# EAGLE design merope-central (EAGLE 6.5.0)
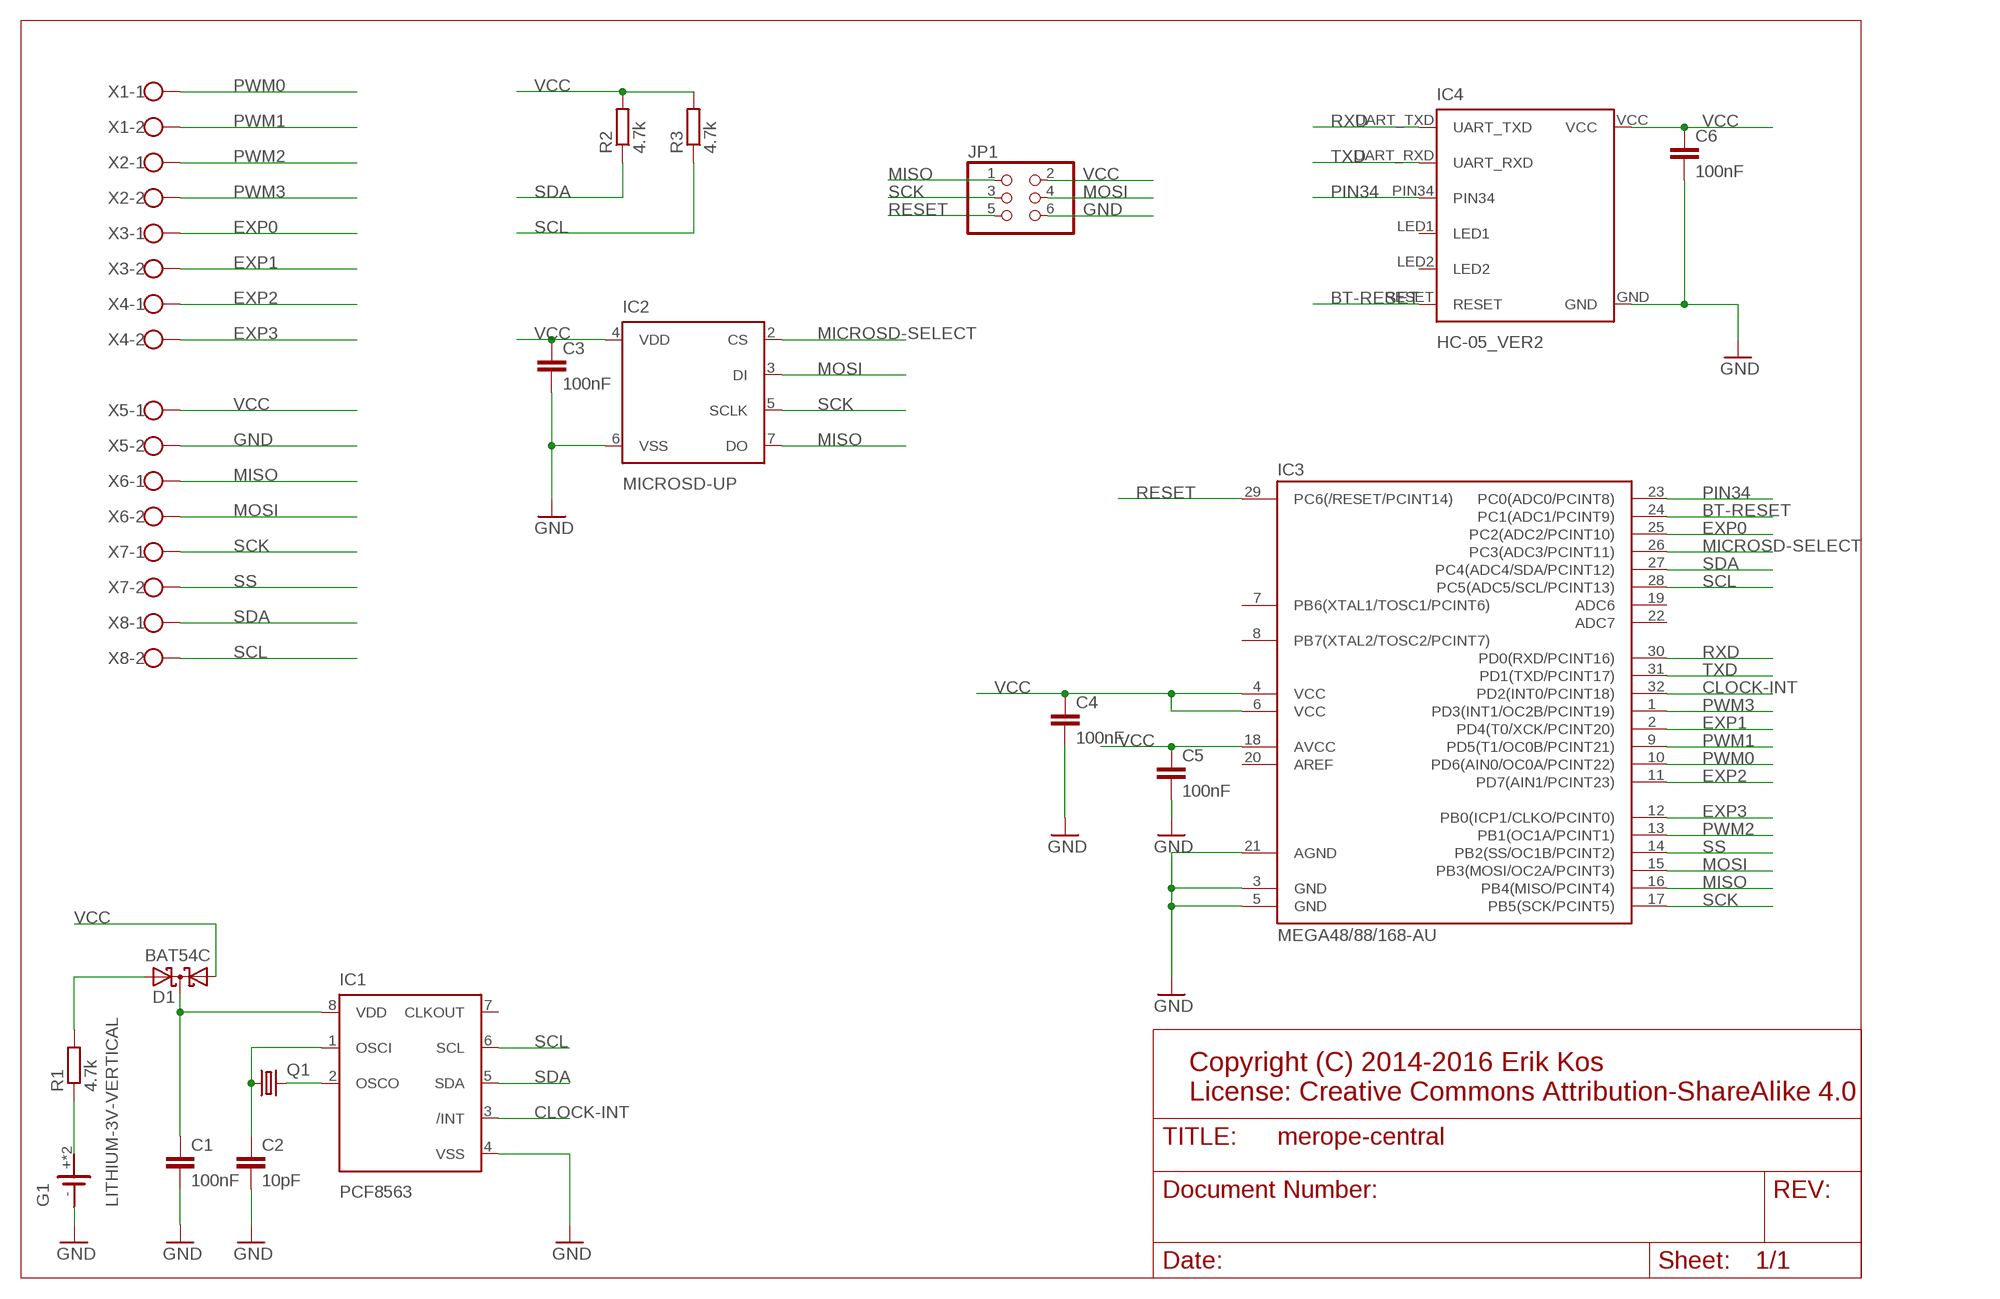
[diagram p0: schematic, sheet 1]

## Parts
C1  100nF  C-EUC0805  [C0805]
C2  10pF  C-EUC0805  [C0805]
C3  100nF  C-EUC0805  [C0805]
C4  100nF  C-EUC0805  [C0805]
C5  100nF  C-EUC0805  [C0805]
C6  100nF  C-EUC0805  [C0805]
D1  BAT54C  [SOT23]
G1  LITHIUM-3V-VERTICAL  [LITHIUM-3V-VERTICAL]
IC1  PCF8563  [SO8]
IC2  MICROSD-UP  [MICROSD-UP]
IC3  MEGA48/88/168-AU  [TQFP32-08]
IC4  HC-05_VER2  [HC-05_VER2]
JP1  PINHD-2X3  [2X03]
Q1  CRYSTALTC26V  [TC26V]
R1  4.7k  R-EU_M0805  [M0805]
R2  4.7k  R-EU_M0805  [M0805]
R3  4.7k  R-EU_M0805  [M0805]
X1  TERMINAL_BLOCK_35_2  [TERMINAL_BLOCK_35_2]
X2  TERMINAL_BLOCK_35_2  [TERMINAL_BLOCK_35_2]
X3  TERMINAL_BLOCK_35_2  [TERMINAL_BLOCK_35_2]
X4  TERMINAL_BLOCK_35_2  [TERMINAL_BLOCK_35_2]
X5  TERMINAL_BLOCK_35_2  [TERMINAL_BLOCK_35_2]
X6  TERMINAL_BLOCK_35_2  [TERMINAL_BLOCK_35_2]
X7  TERMINAL_BLOCK_35_2  [TERMINAL_BLOCK_35_2]
X8  TERMINAL_BLOCK_35_2  [TERMINAL_BLOCK_35_2]

## Nets
BT-RESET: IC3.24(PC1(ADC1/PCINT9)) IC4.RESET
CLOCK-INT: IC1.3(/INT) IC3.32(PD2(INT0/PCINT18))
EXP0: IC3.25(PC2(ADC2/PCINT10)) X3.1
EXP1: IC3.2(PD4(T0/XCK/PCINT20)) X3.2
EXP2: IC3.11(PD7(AIN1/PCINT23)) X4.1
EXP3: IC3.12(PB0(ICP1/CLKO/PCINT0)) X4.2
GND [16mils]: C1.2 C2.2 C3.2 C4.2 C5.2 C6.2 G1.- IC1.4(VSS) IC2.6(VSS) IC3.3(GND) IC3.5(GND) IC3.21(AGND) IC4.GND JP1.6 X5.2
MICROSD-SELECT: IC2.2(CS) IC3.26(PC3(ADC3/PCINT11))
MISO: IC2.7(DO) IC3.16(PB4(MISO/PCINT4)) JP1.1 X6.1
MOSI: IC2.3(DI) IC3.15(PB3(MOSI/OC2A/PCINT3)) JP1.4 X6.2
N$1: C1.1 D1.3(CC) IC1.8(VDD)
N$6: G1.+ G1.+1(+) R1.1
N$7: D1.2(A2) R1.2
N$14: IC1.2(OSCO) Q1.2
N$15: C2.1 IC1.1(OSCI) Q1.1
PIN34: IC3.23(PC0(ADC0/PCINT8)) IC4.PIN34
PWM0: IC3.10(PD6(AIN0/OC0A/PCINT22)) X1.1
PWM1: IC3.9(PD5(T1/OC0B/PCINT21)) X1.2
PWM2: IC3.13(PB1(OC1A/PCINT1)) X2.1
PWM3: IC3.1(PD3(INT1/OC2B/PCINT19)) X2.2
RESET: IC3.29(PC6(/RESET/PCINT14)) JP1.5
RXD: IC3.30(PD0(RXD/PCINT16)) IC4.UART_TXD
SCK: IC2.5(SCLK) IC3.17(PB5(SCK/PCINT5)) JP1.3 X7.1
SCL: IC1.6(SCL) IC3.28(PC5(ADC5/SCL/PCINT13)) R3.1 X8.2
SDA: IC1.5(SDA) IC3.27(PC4(ADC4/SDA/PCINT12)) R2.1 X8.1
SS: IC3.14(PB2(SS/OC1B/PCINT2)) X7.2
TXD: IC3.31(PD1(TXD/PCINT17)) IC4.UART_RXD
VCC [16mils]: C3.1 C4.1 C5.1 C6.1 D1.1(A1) IC2.4(VDD) IC3.4(VCC) IC3.6(VCC) IC3.18(AVCC) IC4.VCC JP1.2 R2.2 R3.2 X5.1
Unconnected: IC1.7(CLKOUT) IC3.7(PB6(XTAL1/TOSC1/PCINT6)) IC3.8(PB7(XTAL2/TOSC2/PCINT7)) IC3.19(ADC6) IC3.20(AREF) IC3.22(ADC7) IC4.LED1 IC4.LED2

## Notes on the sheet
- Copyright (C) 2014-2016 Erik Kos
  License: Creative Commons Attribution-ShareAlike 4.0

## Library data of the parts
C1-C6 = rcl:C-EU: CAPACITOR, European symbol
D1 = diode:BAT54C: Schottky Diodes Source: Fairchild .. BAT54.pdf
G1 = js:LITHIUM-3V-VERTICAL
IC1 = js:PCF8563
IC2 = js:MICROSD-UP
IC3 = avr-5:MEGA48/88/168
IC4 = js:HC-05_VER2
JP1 = pinhead:PINHD-2X3: PIN HEADER
Q1 = crystal:CRYSTAL: CRYSTAL; OC_FARNELL: unknown; OC_NEWARK: unknown
R1-R3 = rcl:R-EU_: RESISTOR, European symbol
X1-X8 = js:TERMINAL_BLOCK_35_2

## Net classes
2 16mils: width 0.406 mm

## Board
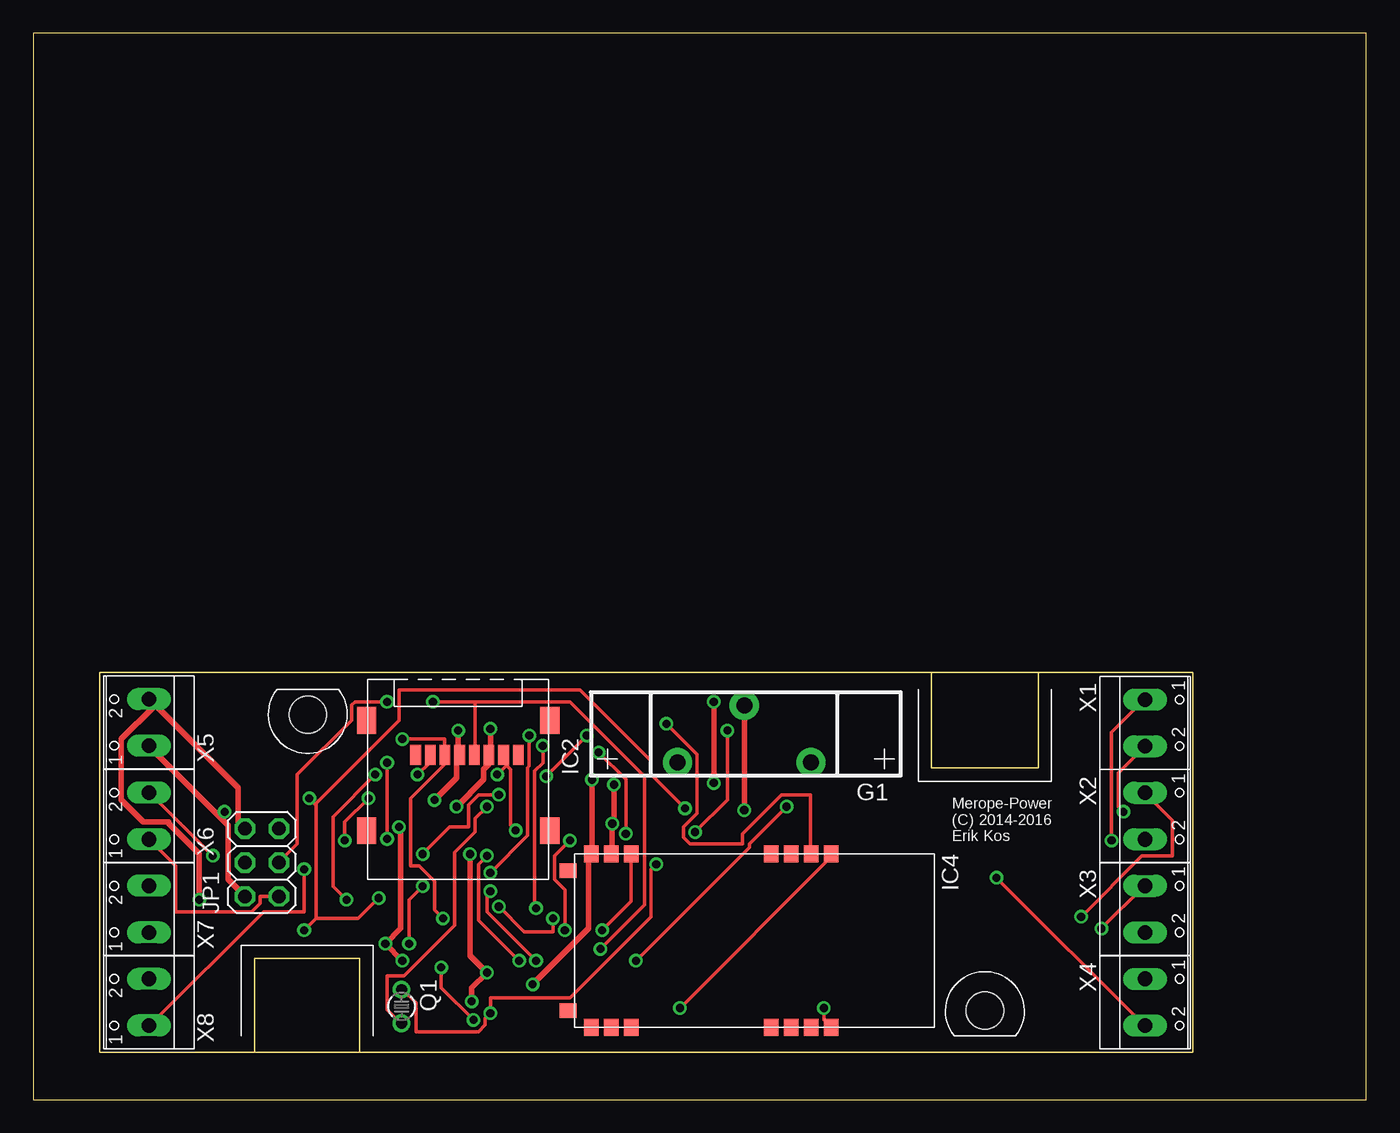
[diagram p1: board, top side]
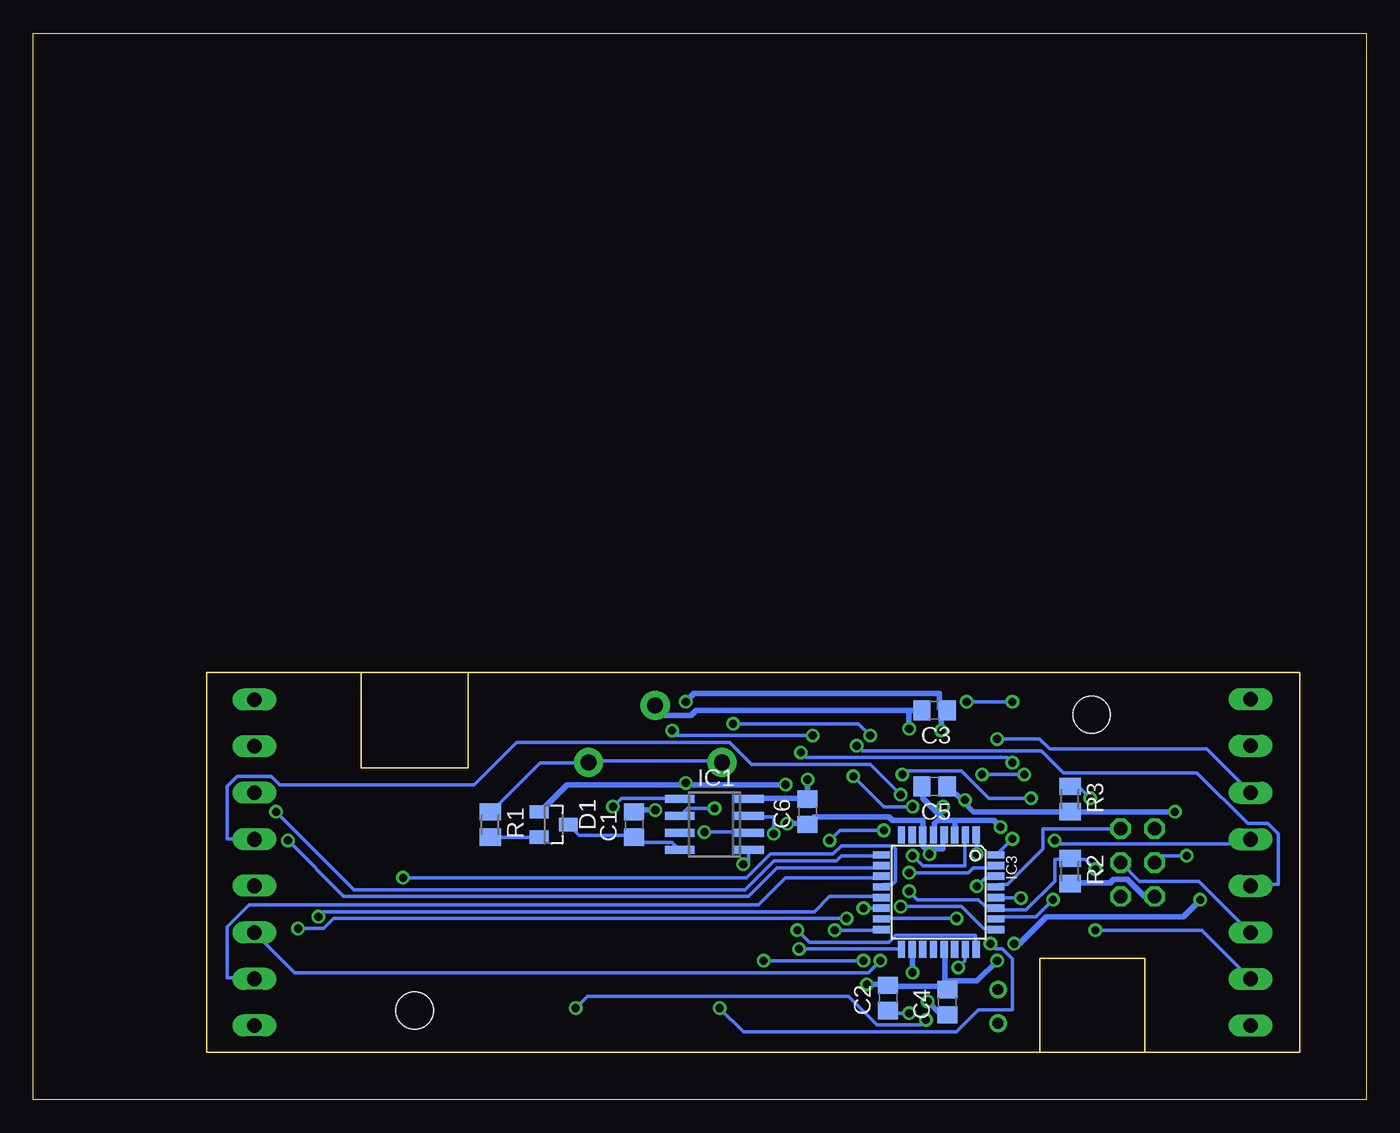
[diagram p2: board, bottom side, seen from below]

Size 100 x 80 mm. Coordinates in mm from the lower left corner, seen from the top.
Outline: 0,0 100,0 100,80 0,80 0,0
Copper layers (1*16): Top 0.035mm / dielectric 1.5mm / Bottom 0.035mm
Design rules "default": minimum track width 10mil, minimum drill 24mil, track to track 8mil, track to pad 8mil, pad to pad 8mil, via to via 8mil, smd to smd 8mil, copper to edge 40mil, drill to drill 8mil, minimum pad ring 10mil, minimum via ring 8mil, stop-mask expansion 4mil, vias tented up to drill 0mil, thermal gap 10mil

### Footprints (pad centres in the part's own frame; a part is rotated, then mirrored left to right if it is on the bottom)
C0805 = smd 1.3 x 1.5: 1 -0.95,0; 2 0.95,0
SOT23 = smd 1 x 1.4: 1 -0.95,-1.1; 2 0.95,-1.1; 3 0,1.1
LITHIUM-3V-VERTICAL = drill 1.2 pad 2.184: + -5,2; +1 5,2; - 0,-2.25
SO8 = smd 2.2 x 0.6: 1 -2.6,1.905; 2 -2.6,0.635; 3 -2.6,-0.635; 4 -2.6,-1.905; 5 2.6,-1.905; 6 2.6,-0.635; 7 2.6,0.635; 8 2.6,1.905
MICROSD-UP = smd 0.8 x 1.5: 1 3.6,9.347; 2 4.7,9.347; 3 5.8,9.347; 4 6.9,9.347; 5 8,9.347; 6 9.1,9.347; 7 10.2,9.347; 8 11.3,9.347 | smd 1.45 x 1.999: G1 13.665,11.938; G2 -0.076,3.658; G3 13.665,3.658; G4 -0.076,11.938
TQFP32-08 = smd 1.27 x 0.559: 1 -4.293,2.8; 2 -4.293,2; 3 -4.293,1.2; 4 -4.293,0.4; 5 -4.293,-0.4; 6 -4.293,-1.2; 7 -4.293,-2; 8 -4.293,-2.8; 17 4.293,-2.8; 18 4.293,-2; 19 4.293,-1.2; 20 4.293,-0.4; 21 4.293,0.4; 22 4.293,1.2; 23 4.293,2; 24 4.293,2.8 | smd 0.559 x 1.27: 9 -2.8,-4.293; 10 -2,-4.293; 11 -1.2,-4.293; 12 -0.4,-4.293; 13 0.4,-4.293; 14 1.2,-4.293; 15 2,-4.293; 16 2.8,-4.293; 25 2.8,4.293; 26 2,4.293; 27 1.2,4.293; 28 0.4,4.293; 29 -0.4,4.293; 30 -1.2,4.293; 31 -2,4.293; 32 -2.8,4.293
HC-05_VER2 = smd 1.27 x 1.067: 3 -7,2.25; 4 -7,0.75; 22 6,-12.75; 23 6,-11.25; 24 6,-9.75; 33 6,3.75; GND -7,-12.75; LED1 6,0.75; LED2 6,2.25; PIN34 6,5.25; RESET -7,-9.75; UART_RXD -7,3.75; UART_TXD -7,5.25; VCC -7,-11.25 | smd 1.067 x 1.27: 14 -5.75,-14.5; 21 4.75,-14.5
2X03 = drill 1.016 octagon: 1 -2.54,-1.27; 2 -2.54,1.27; 3 0,-1.27; 4 0,1.27; 5 2.54,-1.27; 6 2.54,1.27
TC26V = drill 0.813: 1 -1.27,0; 2 1.27,0
M0805 = smd 1.3 x 1.6: 1 -0.95,0; 2 0.95,0
Z-103 = hole 2.8: -26.4,11.1; 24.4,-11.1
TERMINAL_BLOCK_35_2 = drill 1.1 long: 1 -1.75,-0.1; 2 1.75,-0.1

### Placement (x,y rotation side)
C1  54.93,20.64 90 bottom
C2  35.88,7.62 90 bottom
C3  32.38,29.21 180 bottom
C4  31.43,7.3 90 bottom
C5  32.38,23.5 180 bottom
C6  41.91,21.59 90 bottom
D1  60.96,20.64 270 bottom
G1  53.34,27.3 180 top
IC1  48.9,20.64 180 bottom
IC2  25.08,16.51 0 top
IC3  32.07,15.56 270 bottom
IC4  54.61,11.43 270 top
JP1  17.14,17.78 90 top
Q1  27.62,6.99 270 top
R1  65.72,20.64 270 bottom
R2  22.23,17.14 270 bottom
R3  22.23,22.54 270 bottom
U$1  [Z-103]  46.99,17.78 0 top
X1  83.5,28.26 270 top
X2  83.5,21.27 270 top
X3  83.5,14.29 270 top
X4  83.5,7.3 270 top
X5  8.57,28.29 90 top
X6  8.57,21.27 90 top
X7  8.57,14.29 90 top
X8  8.57,7.3 90 top

### Tracks (layer width: path | path; a pad name or v marks a point on that pad's centre or on a via)
BT-RESET  (via drill 0.61)
  Top 0.254: v42.67,12.7 44.83,14.86 44.83,18.41 IC4.RESET
  Bottom 0.254: v42.67,12.7 41.78,11.81 35.81,11.81 35.31,12.32 29.34,12.32 29.34,11.3 IC3.24
CLOCK-INT  (via drill 0.61)
  Top 0.254: v26.54,25.27 v26.54,19.56 | v42.42,26.04 44.45,24 v44.45,19.94
  Bottom 0.254: v26.54,19.56 27.69,18.41 IC3.32 | v26.54,25.27 26.92,25.65 42.04,25.65 v42.42,26.04 | v44.45,19.94 44.45,21.21 46.23,21.21 IC1.3
EXP0  (via drill 0.61)
  Top 0.254: v34.92,14.48 36.83,12.57 38.99,12.57 v38.99,13.59 | v80.14,12.83 83.31,16 X3.1
  Bottom 0.254: v34.92,14.48 30.35,14.48 28.7,12.83 27.81,12.83 IC3.25 | v38.99,13.59 77.47,13.59 78.23,12.83 v80.14,12.83
EXP1  (via drill 0.61)
  Top 0.254: v34.04,18.29 33.4,17.65 33.4,13.46 v36.45,10.41
  Bottom 0.254: v34.04,18.29 33.27,17.53 30.1,17.53 30.1,19.81 IC3.2 | v36.45,10.41 37.34,9.53 80.39,9.53 83.31,12.45 X3.2
EXP2
  Bottom 0.254: IC3.11 36.45,16.64 43.56,16.64 45.59,14.61 83.82,14.61 85.47,12.95 85.47,9.14 83.44,9.14 X4.1
EXP3  (via drill 0.61)
  Top 0.254: v72.26,16.64 83.31,5.59 X4.2
  Bottom 0.254: v72.26,16.64 46.48,16.64 44.7,18.41 40.01,18.41 39.37,19.05 35.56,19.05 35.31,18.8 35.31,16.38 35.56,16.13 36.2,16.13 36.32,16 IC3.12
GND  (via drill 0.61)
  Top 0.406: v34.29,27.81 34.29,25.91 IC2.6 34.16,25.65 34.16,25.15 33.78,24.77 33.78,24 v31.75,21.97 | G1.- v53.34,21.72 | JP1.6 15.37,20.83 15.37,23.37 8.76,29.97 X5.2 9.02,29.46 6.6,27.05 6.6,22.48 8.26,20.83 10.16,20.83 10.16,20.7 12.45,18.41 v12.45,14.99 | v41.91,24 41.91,18.54 IC4.GND 41.66,18.41 41.66,12.83 v37.47,8.64 | v27.69,10.41 v26.42,11.68 27.56,12.83 27.56,20.32 v27.43,20.45
  Bottom 0.406: 30.86,20.95 30.86,19.94 IC3.3 | 31.75,20.95 32.13,20.95 32.38,20.7 32.38,19.94 IC3.5 | 31.75,20.95 30.86,20.95 | 32.26,21.59 31.75,21.08 31.75,20.95 | 32.26,21.59 33.27,22.61 33.27,23.5 C5.2 | 34.29,29.21 50.29,29.21 50.67,28.83 52.7,28.83 53.34,29.46 G1.- | 34.29,29.21 C3.2 | 34.29,29.21 v34.29,27.81 | v53.34,21.72 54.74,21.72 54.86,21.59 C1.2 | 32.26,21.59 31.88,21.97 v31.75,21.97 | IC3.21 31.62,11.18 31.62,8.26 31.5,8.26 C4.2 | C4.2 31.75,8.51 35.81,8.51 C2.2 36.07,8.64 v37.47,8.64 | v41.91,24 C6.2 42.04,22.61 46.23,22.61 IC1.4 | v12.45,14.99 13.72,13.72 24,13.72 26.04,11.68 v26.42,11.68 | v27.69,10.41 29.21,8.89 31.5,8.89 C4.2 | 30.86,20.95 27.94,20.95 v27.43,20.45
MICROSD-SELECT  (via drill 0.61)
  Top 0.254: v23.5,14.99 22.48,16 22.48,21.21 v25.65,24.38 | v28.83,24.38 29.72,25.27 29.72,25.78 IC2.2
  Bottom 0.254: v23.5,14.99 24.77,13.72 27.56,13.72 27.69,13.59 IC3.26 | v28.83,24.38 v25.65,24.38
MISO  (via drill 0.61)
  Top 0.254: v39.88,12.7 39.88,15.75 39.12,16.51 39.12,18.29 v40.26,19.43 | v36.2,20.19 35.81,20.57 35.81,24.77 35.5,25.08 | 35.5,25.08 35.31,25.27 35.31,25.78 IC2.7 | JP1.1 17.02,15.24 17.02,14.73 16.38,14.1 10.67,14.1 10.67,17.53 8.76,19.43 X6.1 | v34.8,24.38 35.5,25.08 | v25.15,22.61 23.37,20.83 v23.37,19.43
  Bottom 0.254: v39.88,12.7 36.45,12.7 IC3.16 | v40.26,19.43 39.5,20.19 v36.2,20.19 | v34.8,24.38 34.54,24.64 30.35,24.64 28.32,22.61 v25.15,22.61 | v23.37,19.43 23.11,19.18 9.02,19.18 8.76,19.43 X6.1
MOSI  (via drill 0.61)
  Top 0.254: v13.46,18.29 8.76,22.99 X6.2 | v30.73,13.59 30.1,14.22 30.1,16.38 28.96,17.53 28.32,17.53 28.32,22.61 30.86,25.15 30.86,25.78 IC2.3 30.86,25.91 30.86,27.05 v27.69,27.05
  Bottom 0.254: JP1.4 15.37,18.29 v13.46,18.29 | v30.73,13.59 36.32,13.59 IC3.15 | v27.69,27.05 24.51,27.05 23.75,26.29 11.94,26.29 8.76,23.11 X6.2
N$1
  Bottom 0.254: D1.3 59.82,20.57 59.05,19.81 54.99,19.81 C1.1 54.86,19.68 54.48,19.3 52.07,19.3 51.56,18.8 IC1.8
N$6
  Bottom 0.254: R1.1 65.66,21.59 61.98,25.27 58.42,25.27 G1.+ 58.29,25.4 48.39,25.4 G1.+1
N$7
  Bottom 0.254: D1.2 62.1,19.68 65.66,19.68 R1.2
N$14  (via drill 0.61)
  Top 0.254: v49.66,20.07 52.07,22.48 v52.07,27.69 | v38.48,24.26 v41.53,27.3 | v34.04,21.97 33.15,21.08 33.15,20.07 31.62,18.54 31.62,13.08 27.81,9.27 26.54,9.27 26.54,6.73 27.56,5.71 Q1.2
  Bottom 0.254: v49.66,20.07 46.35,20.07 IC1.2 | v52.07,27.69 51.69,27.3 v41.53,27.3 | v38.48,24.26 36.2,21.97 v34.04,21.97
N$15  (via drill 0.61)
  Top 0.254: Q1.1 27.69,8.26 28.7,7.24 28.7,5.08 33.4,5.08 33.91,5.59 33.91,6.1 v34.29,6.48 34.29,7.62 40.26,7.62 46.35,13.72 46.35,17.27 v46.74,17.65
  Bottom 0.254: v34.29,6.48 35.69,6.48 35.81,6.6 C2.1 | v46.74,17.65 46.35,17.65 46.35,18.67 IC1.1
PIN34  (via drill 0.61)
  Top 0.254: v59.31,6.86 59.31,5.97 59.82,5.46 IC4.PIN34 | v33.02,5.97 30.61,8.38 v30.61,9.91
  Bottom 0.254: v59.31,6.86 58.42,7.75 38.86,7.75 36.7,5.59 33.4,5.59 v33.02,5.97 | v30.61,9.91 30.1,10.41 30.1,11.18 IC3.23
PWM0  (via drill 0.61)
  Top 0.254: v80.9,19.43 80.9,27.56 83.31,29.97 X1.1
  Bottom 0.254: v80.9,19.43 76.71,15.24 46.35,15.24 44.2,17.4 36.58,17.4 36.45,17.53 IC3.10
PWM1  (via drill 0.61)
  Top 0.254: v81.79,21.59 81.41,21.97 81.41,24.51 83.31,26.42 X1.2
  Bottom 0.254: v81.79,21.59 75.95,15.75 46.61,15.75 44.45,17.91 39.75,17.91 39.37,18.29 36.45,18.29 IC3.9
PWM2  (via drill 0.61)
  Top 0.254: v78.61,13.72 83.19,18.29 85.47,18.29 85.47,20.95 83.44,22.99 X2.1
  Bottom 0.254: v78.61,13.72 78.23,14.1 41.4,14.1 40.26,15.24 36.45,15.24 IC3.13
PWM3  (via drill 0.61)
  Top 0.254: v29.21,18.41 31.24,20.45 32.64,20.45 32.64,22.1 33.4,22.86 v34.92,22.86
  Bottom 0.254: v29.21,18.41 29.21,19.81 IC3.1 | v34.92,22.86 37.21,25.15 46.1,25.15 47.75,26.8 63.75,26.8 66.93,23.62 81.53,23.62 82.17,24.26 84.71,24.26 85.47,23.5 85.47,19.56 83.44,19.56 X2.2
RESET
  Bottom 0.254: JP1.5 24.26,20.32 24.26,18.8 26.92,16.13 27.56,16.13 27.69,16 IC3.29
RXD  (via drill 0.61)
  Top 0.254: v29.21,16 28.19,14.99 v28.19,11.68 | v48.51,6.86 59.82,18.16 59.82,18.41 IC4.UART_TXD
  Bottom 0.254: v29.21,16 28.57,16.64 27.81,16.64 IC3.30 | v28.19,11.68 27.81,11.3 27.3,11.3 26.54,10.54 26.54,6.73 29.08,6.73 30.73,5.08 46.74,5.08 v48.51,6.86
SCK  (via drill 0.61)
  Top 0.254: v42.55,11.3 45.85,14.61 45.85,24.26 40.26,29.84 33.15,29.84 | 33.15,29.84 33.15,25.91 IC2.5 | JP1.3 19.81,19.18 19.81,24.38 23.88,28.45 23.88,29.59 24.13,29.84 v26.54,29.84 | 33.15,29.84 v29.97,29.84
  Bottom 0.254: JP1.3 17.02,16.38 12.57,16.38 8.76,12.57 X7.1 | v42.55,11.3 34.92,11.3 IC3.17 | v29.97,29.84 v26.54,29.84
SCL  (via drill 0.61)
  Top 0.254: v25.91,15.11 24.38,13.59 21.21,13.59 | 21.21,13.59 21.21,22.1 21.14,22.16 | v20.7,22.61 21.14,22.16 | v48.9,21.84 46.35,24.38 46.35,25.4 41.02,30.73 27.43,30.73 27.43,28.45 21.14,22.16 | 21.21,13.59 v20.32,12.7
  Bottom 0.254: v25.91,15.11 27.69,15.11 IC3.28 | v20.7,22.61 21.46,23.37 22.23,23.37 R3.1 | v48.9,21.84 50.93,21.84 51.44,21.34 IC1.6 | v20.32,12.7 12.32,12.7 8.76,9.14 X8.2
SDA  (via drill 0.61)
  Top 0.254: v56.52,21.97 53.72,19.18 53.72,18.92 v45.21,10.41 | v37.72,10.41 34.04,14.1 34.04,15.37 v34.29,15.62 | v20.32,17.27 20.32,14.1 17.27,14.1 8.76,5.59 X8.1
  Bottom 0.254: 22.23,18.03 23.37,18.03 23.37,16.38 25.53,14.22 27.56,14.22 27.69,14.35 IC3.27 27.81,14.48 28.57,14.48 29.08,14.99 33.66,14.99 v34.29,15.62 | v56.52,21.97 55.88,22.61 51.56,22.61 IC1.5 | v37.72,10.41 v45.21,10.41 | v20.32,17.27 21.08,18.03 22.23,18.03 | 22.23,18.03 R2.1
SS  (via drill 0.61)
  Top 0.254: v37.72,14.35 37.59,14.48 37.59,24.64 38.23,25.27 v38.23,26.54
  Bottom 0.254: v37.72,14.35 36.45,14.35 IC3.14 | v38.23,26.54 37.85,26.16 24.38,26.16 22.73,24.51 12.7,24.51 8.89,20.7 7.37,20.7 6.6,19.94 6.6,16.13 8.64,16.13 X7.2
TXD  (via drill 0.61)
  Top 0.254: v34.29,17.02 37.08,19.81 37.08,24.89 37.21,25.02 v37.21,27.3 | v47.5,28.19 49.78,25.91 49.78,21.46 48.77,20.45 48.77,19.68 49.28,19.18 53.21,19.18 53.21,19.94 56.13,22.86 58.29,22.86 58.29,18.54 IC4.UART_RXD
  Bottom 0.254: v34.29,17.02 29.84,17.02 29.46,17.4 27.94,17.4 27.81,17.53 IC3.31 | v37.21,27.3 38.1,28.19 v47.5,28.19
VCC  (via drill 0.61)
  Top 0.406: v31.88,27.69 31.88,25.91 IC2.4 32,25.65 31.75,25.4 31.75,24.13 v30.1,22.48 | 13.97,21.21 14.61,20.57 14.61,16.51 JP1.2 | 13.97,21.21 8.76,26.42 X5.1 | 13.97,21.21 v14.35,21.59 | v32.89,7.37 32.89,8.38 v34.04,9.53 32.77,10.79 v32.77,18.41 | IC4.VCC 43.43,18.54 v43.43,20.7 43.56,20.83 v43.56,23.62 | v51.05,23.75 v51.05,29.84
  Bottom 0.406: v31.88,27.69 31.88,29.21 C3.1 32,29.34 32,30.48 50.42,30.48 v51.05,29.84 | 30.23,22.35 29.46,21.59 R3.2 22.1,21.59 v14.35,21.59 | 30.23,22.35 31.37,23.5 C5.1 | v30.1,22.48 30.23,22.35 | JP1.2 16.64,15.24 17.91,16.51 18.92,16.51 19.18,16.26 22.23,16.26 R2.2 | v34.04,9.53 34.04,11.18 IC3.18 | v32.89,7.37 32,6.48 31.5,6.48 C4.1 | 32.77,18.8 33.02,18.8 33.27,19.05 33.27,19.81 IC3.6 33.27,19.94 33.27,20.95 35.56,20.95 35.81,21.21 41.4,21.21 41.78,20.83 C6.1 41.91,20.7 v43.43,20.7 | 32.77,18.8 31.75,18.8 31.75,19.81 IC3.4 | v43.56,23.62 51.05,23.62 | 51.05,23.62 59.94,23.62 61.98,21.59 D1.1 | 32.77,18.8 v32.77,18.41 | v51.05,23.75 51.05,23.62

### Text on the board
tNames: Merope-Power / (C) 2014-2016 / Erik Kos